# Altium schematic sheet [7] Accumulator_Indicator.SchDoc
size A4
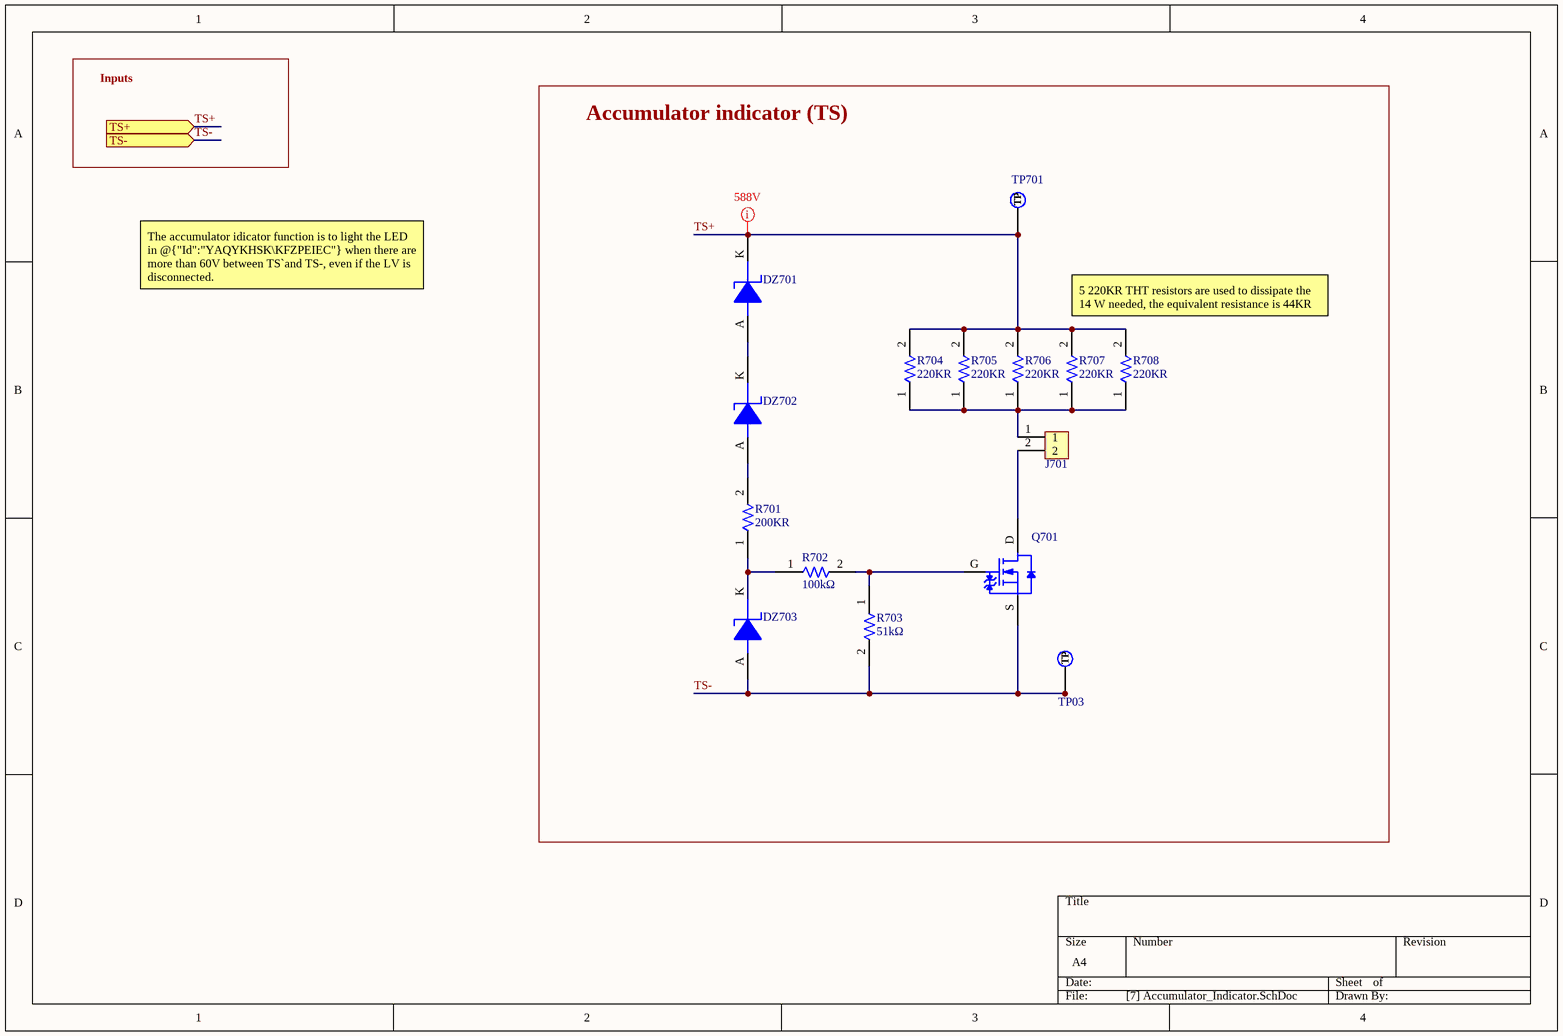
[diagram p0: [7] Accumulator_Indicator.SchDoc]

## Parts
DZ701  DZ_24V  [DZ_SMB-2]  (value not drawn)
DZ702  DZ_24V  [DZ_SMB-2]  (value not drawn)
DZ703  DZ_10V  [SOD123]  (value not drawn)
J701  436500215  [J_MicroFit_2x1]  (value not drawn)
Q701  IRLR2905  [IRLR2905]  (value not drawn)
R701  200KR  [THT_RESISTOR]
R702  Resistance: 100kΩ  [R1206FTK-W]  (hidden comment: CRG1206F100R)
R703  Resistance: 51kΩ  [R1206FTK-W]  (hidden comment: CRCW120610K0FKEA)
R704  220KR  [THT_RESISTOR]
R705  220KR  [THT_RESISTOR]
R706  220KR  [THT_RESISTOR]
R707  220KR  [THT_RESISTOR]
R708  220KR  [THT_RESISTOR]
TP03  TestPoint  [TestPoint]  (value not drawn)  (no BOM)
TP701  TestPoint  [TestPoint]  (value not drawn)  (no BOM)

## Blocks framed on the sheet
Accumulator indicator (TS): DZ701-DZ703 J701 Q701 R701-R708 TP03 TP701

## Ports
TS+ (in), TS- (in)

## Nets
TS+: DZ701.K R704.2 R705.2 R706.2 R707.2 R708.2 TP701.1(TP) ; port TS+
TS-: DZ703.A Q701.S R703.2 TP03.1(TP) ; port TS-
NetDZ701_A: DZ701.A DZ702.K
NetDZ702_A: DZ702.A R701.2
NetDZ703_K: DZ703.K R701.1 R702.1
NetJ701_1: J701.1 R704.1 R705.1 R706.1 R707.1 R708.1
NetJ701_2: J701.2 Q701.D
NetQ701_G: Q701.G R702.2 R703.1

## Layout directives
mark named 588V: TS+

## Notes on the sheet
- Inputs
- The accumulator idicator function is to light the LED in @{"Id":"YAQYKHSK\KFZPEIEC"} when there are more than 60V between TS`and TS-, even if the LV is disconnected.
- 5 220KR THT resistors are used to dissipate the 14 W needed, the equivalent resistance is 44KR

## Library data of the parts
DZ701 DZ702 = DZ_24V: 3.0 W Zener Diode Voltage Regulator 24 V (Automotive); Manufacturer: Diodes; Manufacturer Part Number: BZT52C5V1-7-F; Forward Current: 10mA; Max Power Dissipation: 3W; Tolerance: 5%; Zener Voltage: 24V; Impedance: 19R; Max Reverse Leakage Current: 1uA; RoHS: Yes; Category: Zener Diodes; Stock 1: 2118; Pricing 1: 1=0,79, 10=0,685, 100=0,4743, 500=0,39628, 1000=0,33726 (USD); ComponentLink1URL: https://datasheet.ciiva.com/15142/getdatasheetpartid-75143-15142417.pdf?src-supplier=Verical; ComponentLink1Description: https://datasheet.ciiva.com/15142/getdatasheetpartid-75143-15142417.pdf?src-supplier=Verical; ComponentLink2URL: https://datasheet.ciiva.com/4734/ds18004-73542-4734246.pdf?src-supplier=Mouser; ComponentLink2Description: https://datasheet.ciiva.com/4734/ds18004-73542-4734246.pdf?src-supplier=Mouser; ComponentLink3URL: https://datasheet.ciiva.com/22713/1670962-22713975.pdf?src-supplier=Element14; ComponentLink3Description: https://datasheet.ciiva.com/22713/1670962-22713975.pdf?src-supplier=Element14; Supplier 1: Digi-Key; Case/Package: SMB; Pins: 2; Min Operating Temperature: -65°C; Max Operating Temperature: 150°C; Series: Automotive, AEC-Q101; Packaging: Tape and Reel; Radiation Hardening: No; RoHS Compliant: Yes; Lead Free: Lead Free; Halogen Free: Halogen Free; ComponentLink4URL: https://datasheet.ciiva.com/10638/1smb5913bt3-d-10638009.pdf?src-supplier=Avnet; ComponentLink4Description: https://datasheet.ciiva.com/10638/1smb5913bt3-d-10638009.pdf?src-supplier=Avnet; Supplier Part Number 1: 488-SZ1SMB5934BT3GCT-ND
DZ703 = DZ_10V: BZT52C5V1 Series 500 mW 5.1 V 10 mA Surface Mount Zener Diode - SOD-123; Manufacturer: Diodes; Manufacturer Part Number: BZT52C5V1-7-F; Forward Current: 10mA; Supplier 1: Future Electronics; RoHS: Yes; Category: Zener Diodes; Stock 1: 678000; Pricing 1: 3000=0,0147, 12000=0,0141, 45000=0,0135, 90000=0,0132, 225000=0,0126 (USD); ComponentLink1URL: https://datasheet.ciiva.com/15142/getdatasheetpartid-75143-15142417.pdf?src-supplier=Verical; ComponentLink1Description: https://datasheet.ciiva.com/15142/getdatasheetpartid-75143-15142417.pdf?src-supplier=Verical; ComponentLink2URL: https://datasheet.ciiva.com/4734/ds18004-73542-4734246.pdf?src-supplier=Mouser; ComponentLink2Description: https://datasheet.ciiva.com/4734/ds18004-73542-4734246.pdf?src-supplier=Mouser; ComponentLink3URL: https://datasheet.ciiva.com/22713/1670962-22713975.pdf?src-supplier=Element14; ComponentLink3Description: https://datasheet.ciiva.com/22713/1670962-22713975.pdf?src-supplier=Element14; Supplier Part Number 1: 9109935
J701 = J_MicroFit_2x1: Header 1 Row Vertical Polarizing Peg 2 Pin SMT/Glow Wire Compatible Tin Plate; Manufacturer 1: Molex; Manufacturer Part Number 1: 43650-0215; Supplier 1: Arrow Electronics; RoHS: Yes; Category: Headers and Wire Housings; Stock 1: 11086; Pricing 1: 1=0,87800, 10=0,74400, 80=0,63070, 3264=0,47000, 6528=0,45100, 13056=0,41760 (USD); ComponentLink1URL: https://datasheet.ciiva.com/19462/884109-19462034.pdf?src-supplier=Jameco; ComponentLink1Description: https://datasheet.ciiva.com/19462/884109-19462034.pdf?src-supplier=Jameco; ComponentLink2URL: https://datasheet.ciiva.com/5157/0436500215-pcb-headers-148687-5157608.pdf?src-supplier=Mouser; ComponentLink2Description: https://datasheet.ciiva.com/5157/0436500215-pcb-headers-148687-5157608.pdf?src-supplier=Mouser; ComponentLink3URL: https://datasheet.ciiva.com/16085/0436500215-pcb-headers-16085668.pdf?src-supplier=Onlinecomponents.com; ComponentLink3Description: https://datasheet.ciiva.com/16085/0436500215-pcb-headers-16085668.pdf?src-supplier=Onlinecomponents.com; ComponentLink4URL: https://datasheet.ciiva.com/11748/0900766b80307ce2-11748388.pdf?src-supplier=RSComponents; ComponentLink4Description: https://datasheet.ciiva.com/11748/0900766b80307ce2-11748388.pdf?src-supplier=RSComponents; ComponentLink5URL: https://datasheet.ciiva.com/9432/0436500215-pcb-headers-9432850.pdf?src-supplier=Avnet; ComponentLink5Description: https://datasheet.ciiva.com/9432/0436500215-pcb-headers-9432850.pdf?src-supplier=Avnet; ComponentLink6URL: https://datasheet.ciiva.com/7920/1889390-7920892.pdf?src-supplier=Element14; ComponentLink6Description: https://datasheet.ciiva.com/7920/1889390-7920892.pdf?src-supplier=Element14; Supplier Part Number 1: 43650-0215
Q701 = TRT-NCH-55V-42A: MOSFET N-CH 55V 42A DPAK; Manufacturer 1: Infineon; Manufacturer Part Number 1: IRFR3410TRPBF; Manufacturer Part Number: IRLR2905TRPBF; Continuous Drain Current (ID): 31A; Power Dissipation: 110W; Gate to Source Voltage (Vgs): 20V; Drain to Source Voltage (Vdss): 100V; Rds On Max: 39mR; Input Capacitance: 1.69nF; Max Power Dissipation: 3W; Turn-Off Delay Time: 40ns; Turn-On Delay Time: 12ns; Threshold Voltage: 4V; Polarization: N; ComponentLink2Description: Datasheet; ComponentLink2URL: https://www.mouser.es/datasheet/2/427/sq2318bes-1868475.pdf; RoHS: Yes; Category: MOSFETs; Stock 1: 239; Pricing 1: 1=1,37, 10=1,13, 50=1,13, 100=0,87, 1000=0,615, 10000=0,525 (USD); Mount: Surface Mount; Case/Package: TO-252-3; Number of Pins: 3; Min Operating Temperature: -55°C; Max Operating Temperature: 175°C; Packaging: Cut Tape; Drain to Source Resistance: 39mR; Drain to Source Breakdown Voltage: 100V; Series: HEXFET®; Max Dual Supply Voltage: 100V; Length: 0.264inch; Width: 0.245inch; Height: 0.094inch; Lead Free: Contains Lead; RoHS Compliant: Yes; Reach SVHC Compliant: Yes; Halogen Free: Halogen Free; Supplier 1: Mouser; Manufacturer: Infineon; Supplier Part Number 1: 942-IRLR2905TRPBF
R701 = R_200K_THT
R702 = R100-1206FTK: Res Thick Film 1206 100 Ohm 1% 0.25W(1/4W) ±200ppm/C Pad SMD T/R; Manufacturer: TE Connectivity; Temperature Coefficient: 200ppm/°C; Max Power Dissipation: 250mW; Voltage Rating: 200V; Number of Resistors: 1; .Creator: AC; Category: Resistor; ComponentLink1Description: Datasheet; ComponentLink1URL: https://docs.rs-online.com/7aab/0900766b815b7339.pdf; ComponentLink2Description: Where buy it; ComponentLink2URL: https://es.rs-online.com/web/p/resistencias-de-montaje-en-superficie/2232120; Supplier 1: Digi-Key; Manufacturer Part Number: CRG1206F100R; RoHS: Yes; Stock 1: 13476; Pricing 1: 1=0,10000, 10=0,07600, 100=0,02920, 1000=0,01285, 2500=0,01110 (USD); Mount: Surface Mount; Case/Package: 1206; Case Code (Imperial): 1206; Case Code (Metric): 3216; Weight: 0.000571oz; Min Operating Temperature: -55°C; Max Operating Temperature: 125°C; Tolerance: 1%; Resistor Type: Thick Film; Packaging: Tape and Reel; Package Quantity: 5000; Number of Terminations: 2; Series: CRG, Neohm; Power Rating: 250mW; Termination: Solder; Technology: THICK FILM; Length: 3.1mm; Width: 1.55mm; Height: 0.55mm; Depth: 1.55mm; Radiation Hardening: No; RoHS Compliant: Yes; ELV: Compliant; ComponentLink3URL: https://datasheet.ciiva.com/11808/0900766b800a696e-11808648.pdf?src-supplier=RSComponents; ComponentLink3Description: https://datasheet.ciiva.com/11808/0900766b800a696e-11808648.pdf?src-supplier=RSComponents; ComponentLink4URL: https://datasheet.ciiva.com/16763/70063020-16763547.pdf?src-supplier=Allied+Electronics; ComponentLink4Description: https://datasheet.ciiva.com/16763/70063020-16763547.pdf?src-supplier=Allied+Electronics; ComponentLink5URL: https://datasheet.ciiva.com/5562/eng-ds-1773204-g-5562604.pdf?src-supplier=Mouser; ComponentLink5Description: https://datasheet.ciiva.com/5562/eng-ds-1773204-g-5562604.pdf?src-supplier=Mouser; Supplier Part Number 1: A106068CT-ND
R703 = R51k-1206FTK: Res Thick Film 1206 51K Ohm 1% 1/4W ±100ppm/°C Molded SMD SMD Punched Carrier T/R; Manufacturer: Panasonic; Manufacturer Part Number: ERJ-S08F5102V; Power Rating: 250mW; Voltage Rating: 150V; Voltage Rating (DC): 200V; Current Rating: 2A; .Creator: DO; Category: Resistor; ComponentLink1Description: Datasheet; ComponentLink1URL: https://docs.rs-online.com/bca8/A700000006404581.pdf; ComponentLink2Description: Where buy it; ComponentLink2URL: https://es.rs-online.com/web/p/resistencias-de-montaje-en-superficie/6791765; Supplier 1: Mouser; RoHS: Yes; Stock 1: 4091; Pricing 1: 1=0,31000, 10=0,26700, 50=0,26700, 100=0,10700, 1000=0,05100, 10000=0,03400 (USD); Mount: Surface Mount; Case/Package: 1206; Case Code (Metric): 3216; Case Code (Imperial): 1206; Contact Plating: Tin; Min Operating Temperature: -55°C; Max Operating Temperature: 155°C; Packaging: Tape and Reel; Tolerance: 1%; Package Quantity: 5000; Resistor Type: Thick Film; Number of Terminations: 2; Temperature Coefficient: 100ppm/°C; Max Power Dissipation: 250mW; Features: Anti-Sulfur; Series: ERJ; Construction: Rectangular; Length: 3.2mm; Width: 0.063inch; Height: 0.028inch; Depth: 1.6mm; Military Standard: Not; Lead Free: Lead Free; RoHS Compliant: Yes; ComponentLink3URL: https://datasheet.ciiva.com/24023/aoa0000ce5-24023518.pdf?src-supplier=Mouser; ComponentLink3Description: https://datasheet.ciiva.com/24023/aoa0000ce5-24023518.pdf?src-supplier=Mouser; ComponentLink4URL: https://datasheet.ciiva.com/9189/aoa0000ce5-9189211.pdf?src-supplier=Avnet; ComponentLink4Description: https://datasheet.ciiva.com/9189/aoa0000ce5-9189211.pdf?src-supplier=Avnet; Supplier Part Number 1: 667-ERJ-S08F5102V
R704-R708 = R_220K_THT
TP03 TP701 = TestPoint: Test Point 1x1 mm; .Creator: GP; Category: TestPoint; .PCBcheck: GP; .SCHcheck: GP